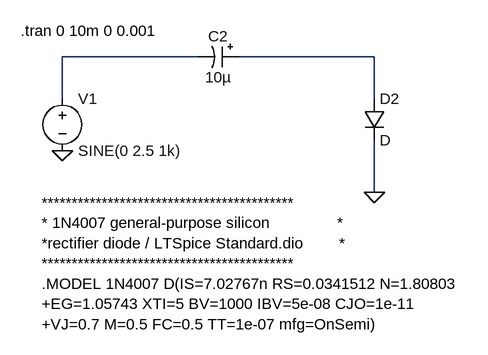
[diagram p0: schematic lab_eletronicos_1_3.asc]
lab_eletronicos_1_3.asc, the LTspice schematic file:
Version 4
SHEET 1 2744 1684
WIRE 1584 880 1376 880
WIRE 1856 880 1648 880
WIRE 1376 944 1376 880
WIRE 1856 944 1856 880
WIRE 1856 1088 1856 1008
FLAG 1856 1088 0
FLAG 1376 1024 0
SYMBOL voltage 1376 928 R0
SYMATTR InstName V1
SYMATTR Value SINE(0 2.5 1k)
SYMATTR Value2 AC 2.5
SYMBOL polcap 1648 864 R90
WINDOW 0 0 32 VBottom 2
WINDOW 3 32 32 VTop 2
SYMATTR InstName C2
SYMATTR Value 10µ
SYMBOL diode 1840 944 R0
SYMATTR InstName D2
TEXT 1312 840 Left 2 !.tran 0 10m 0 0.001
TEXT 1344 1104 Left 2 !******************************************\n* 1N4007 general-purpose silicon       		*\n*rectifier diode / LTSpice Standard.dio		*\n******************************************\n.MODEL 1N4007 D(IS=7.02767n RS=0.0341512 N=1.80803 \n+EG=1.05743 XTI=5 BV=1000 IBV=5e-08 CJO=1e-11 \n+VJ=0.7 M=0.5 FC=0.5 TT=1e-07 mfg=OnSemi)

The netlist it stands for:
* lab_eletronicos_1_3.asc
V1 N001 0 SINE(0 2.5 1k) AC 2.5
C2 N002 N001 10µ
D2 N002 0 D
.model D D
.lib standard.dio
.tran 0 10m 0 0.001
******************************************
* 1N4007 general-purpose silicon       		*
*rectifier diode / LTSpice Standard.dio		*
******************************************
.MODEL 1N4007 D(IS=7.02767n RS=0.0341512 N=1.80803
+EG=1.05743 XTI=5 BV=1000 IBV=5e-08 CJO=1e-11
+VJ=0.7 M=0.5 FC=0.5 TT=1e-07 mfg=OnSemi)
.backanno
.end